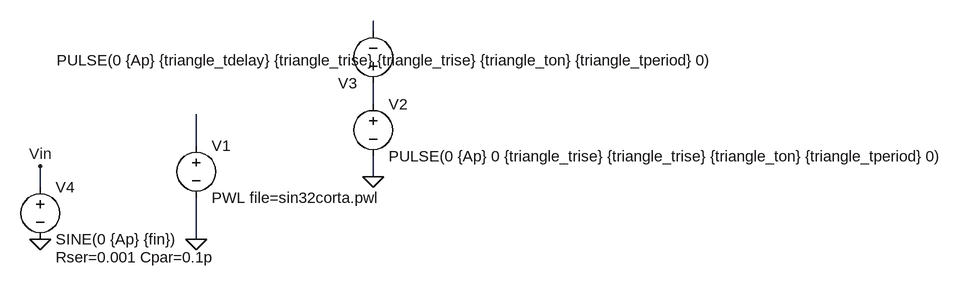
[diagram p0: schematic OTRAS SEÑALES.asc]
OTRAS SEÑALES.asc, the LTspice schematic file:
Version 4
SHEET 1 1240 680
WIRE 208 -96 208 -112
WIRE 208 16 208 -16
WIRE -64 80 -64 32
WIRE 208 128 208 96
WIRE -304 144 -304 112
WIRE -64 224 -64 160
FLAG -64 224 0
FLAG 208 128 0
FLAG -304 224 0
FLAG -304 112 Vin
SYMBOL voltage -64 64 R0
WINDOW 123 0 0 Left 0
WINDOW 39 0 0 Left 0
SYMATTR InstName V1
SYMATTR Value PWL file=sin32corta.pwl
SYMBOL voltage 208 0 R0
WINDOW 123 0 0 Left 0
WINDOW 39 0 0 Left 0
SYMATTR InstName V2
SYMATTR Value PULSE(0 {Ap} 0 {triangle_trise} {triangle_trise} {triangle_ton} {triangle_tperiod} 0)
SYMBOL voltage 208 0 R180
WINDOW 3 -539 51 Left 2
WINDOW 123 0 0 Left 0
WINDOW 39 0 0 Left 0
SYMATTR Value PULSE(0 {Ap} {triangle_tdelay} {triangle_trise} {triangle_trise} {triangle_ton} {triangle_tperiod} 0)
SYMATTR InstName V3
SYMBOL voltage -304 128 R0
WINDOW 123 0 0 Left 0
WINDOW 39 24 124 Left 2
SYMATTR SpiceLine Rser=0.001 Cpar=0.1p
SYMATTR InstName V4
SYMATTR Value SINE(0 {Ap} {fin})

The netlist it stands for:
* OTRAS SEÑALES.asc
V1 N003 0 PWL file=sin32corta.pwl
V2 N002 0 PULSE(0 {Ap} 0 {triangle_trise} {triangle_trise} {triangle_ton} {triangle_tperiod} 0)
V3 N002 N001 PULSE(0 {Ap} {triangle_tdelay} {triangle_trise} {triangle_trise} {triangle_ton} {triangle_tperiod} 0)
V4 Vin 0 SINE(0 {Ap} {fin}) Rser=0.001 Cpar=0.1p
.backanno
.end